# Altium schematic sheet Mechanical.SchDoc: Blood Flow Phantom
size A4; ApprovedBy: Sergei Vostrikov; CheckedBy: Sergei Vostrikov; Author: Ilia Nazemtsev; CompanyName: ETH Zurich; DrawnBy: Ilia Nazemtsev; Organization: Integrated Systems Laboratory; Address1: Gloriastrasse 35; Address2: 8092 Zurich; Address3: ETZ J69; Revision: 1.0; SheetNumber: 3; SheetTotal: 3; Laboratory: Integrated Systems Laboratory
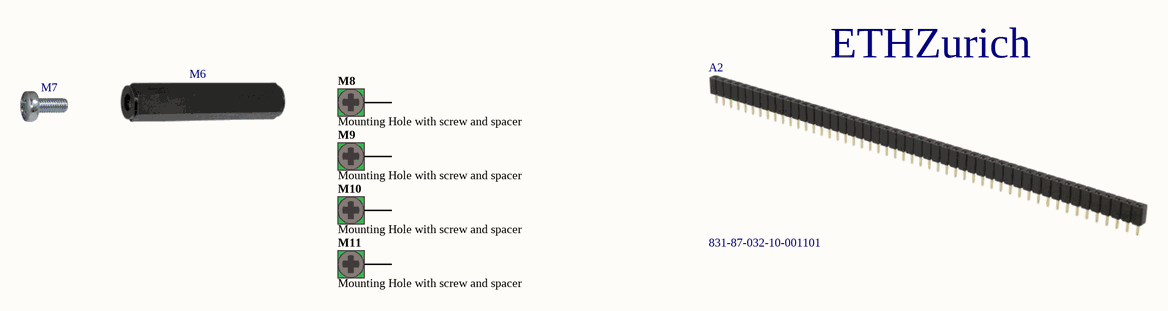
[diagram p0: Mechanical.SchDoc]

## Parts
A1  Logo ETH Zurich  [eth-zurich_5mm]  (value not drawn)  (no BOM)
A2  831-87-032-10-001101  (mechanical)
M6  Spacer M3  (value not drawn)  (mechanical)
M7  Screw M3x8  (value not drawn)  (mechanical)
M8  Mounting Hole with screw and spacer  [Hole M3 with screw]  (no BOM)
M9  Mounting Hole with screw and spacer  [Hole M3 with screw]  (no BOM)
M10  Mounting Hole with screw and spacer  [Hole M3 with screw]  (no BOM)
M11  Mounting Hole with screw and spacer  [Hole M3 with screw]  (no BOM)

## Nets

Not connected (* = marked no-connect by the designer): M8 1; M9 1; M10 1; M11 1

## Notes on the sheet
- 1
- 2
- 3
- 4
- A
- B
- C
- Project:
- D
- Date:
- Drawing number:
- Rev:
- Format:
- A4 Q
- Drawn by:
- Laboratory:
- Page
- Sheet:
- of
- File:
- (in symbol CMP-00038-1) ETHZurich

## Library data of the parts
A1 = CMP-00038-1
A2 = CMP-00706-1: Max Current Rating: 3A; Contact Resistance: 10mR; Number of Positions: 32; Max Voltage Rating (AC): 100V; Max Voltage Rating (DC): 150V; Connector Type: Socket; Gender: Female; Pitch: 2mm; Mount: Through Hole; Case/Package: SIP; Contact Plating: Gold; Contact Material: Copper; Colour: Black; Housing Colour: Black; Housing Material: Polymer; Min Operating Temperature: -55°C; Max Operating Temperature: 125°C; Number of Rows: 1; Package Quantity: 300; Packaging: Box; Termination: Solder; Number of Contacts: 32; Orientation: Straight; Length: 64mm; Depth: 2.2mm; Radiation Hardening: No
M6 = CMP-00018-1: Spacer M3 - 38mm; Form: Hexagonal - Female - Female; Size: 38mm; Material: Nylon; Color: Natural
M7 = CMP-00004-1: Screw M3x8 Pan Head Phillips; Form: Pan Head; Size: M3x8; Head Type: Phillips
M8-M11 = CMP-00214-1: Mounting Hole, 7.2mm pad, 3.2mm plated hole; ClassName: Mounting Hole